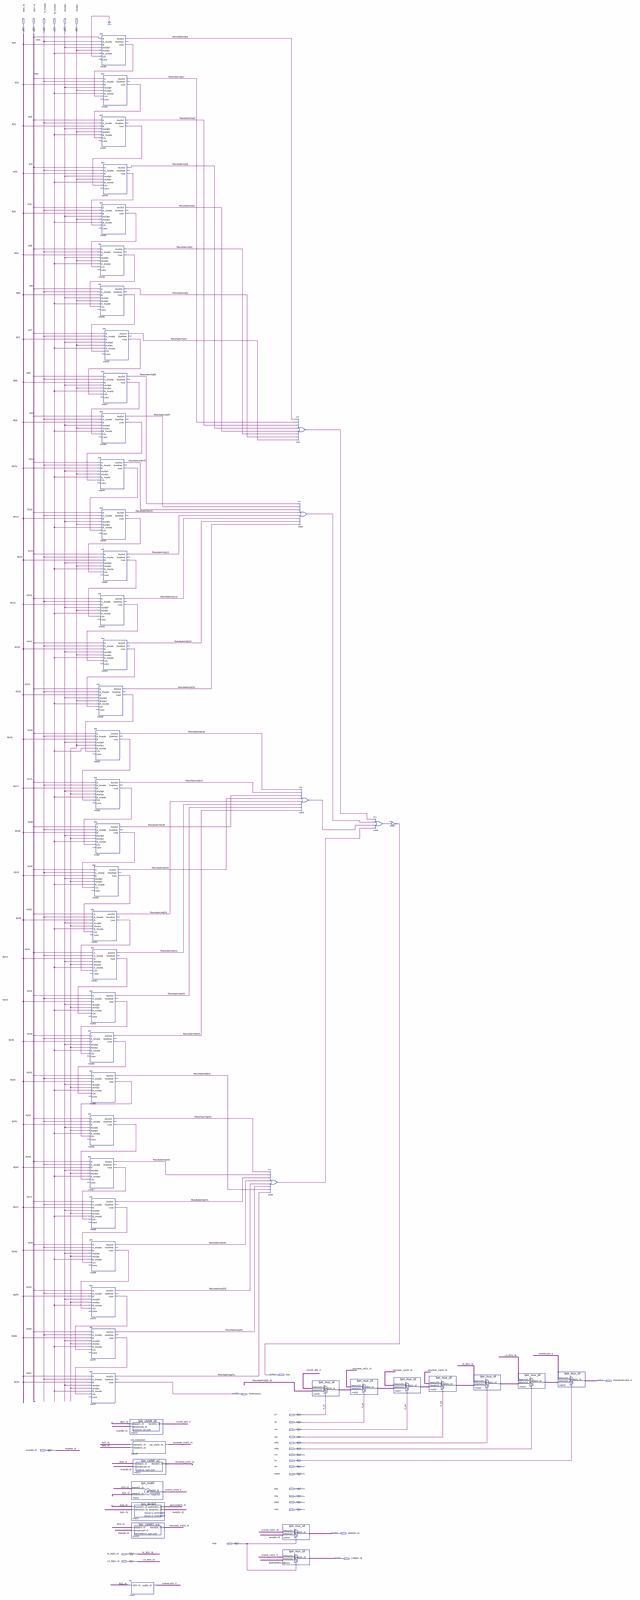
[diagram p0: schematic sheet, whole]
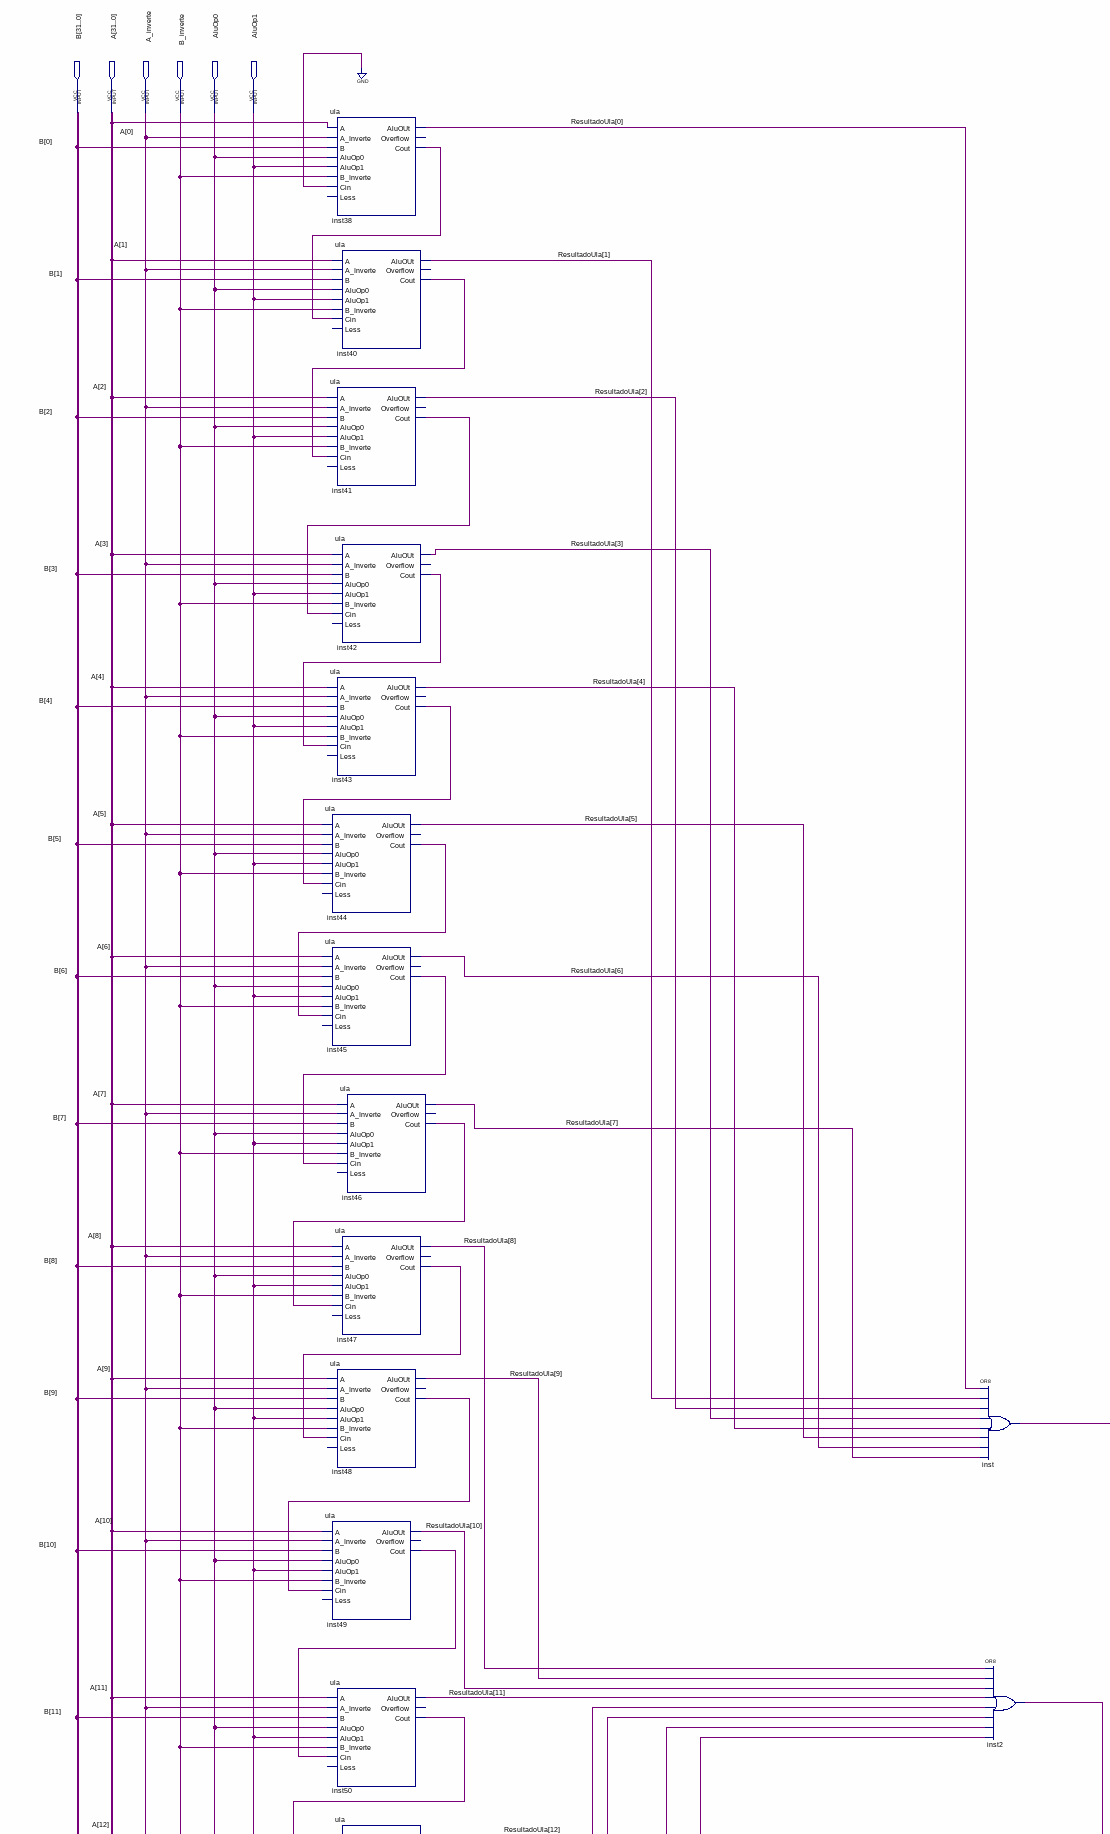
[diagram p1: schematic sheet, upper left part]
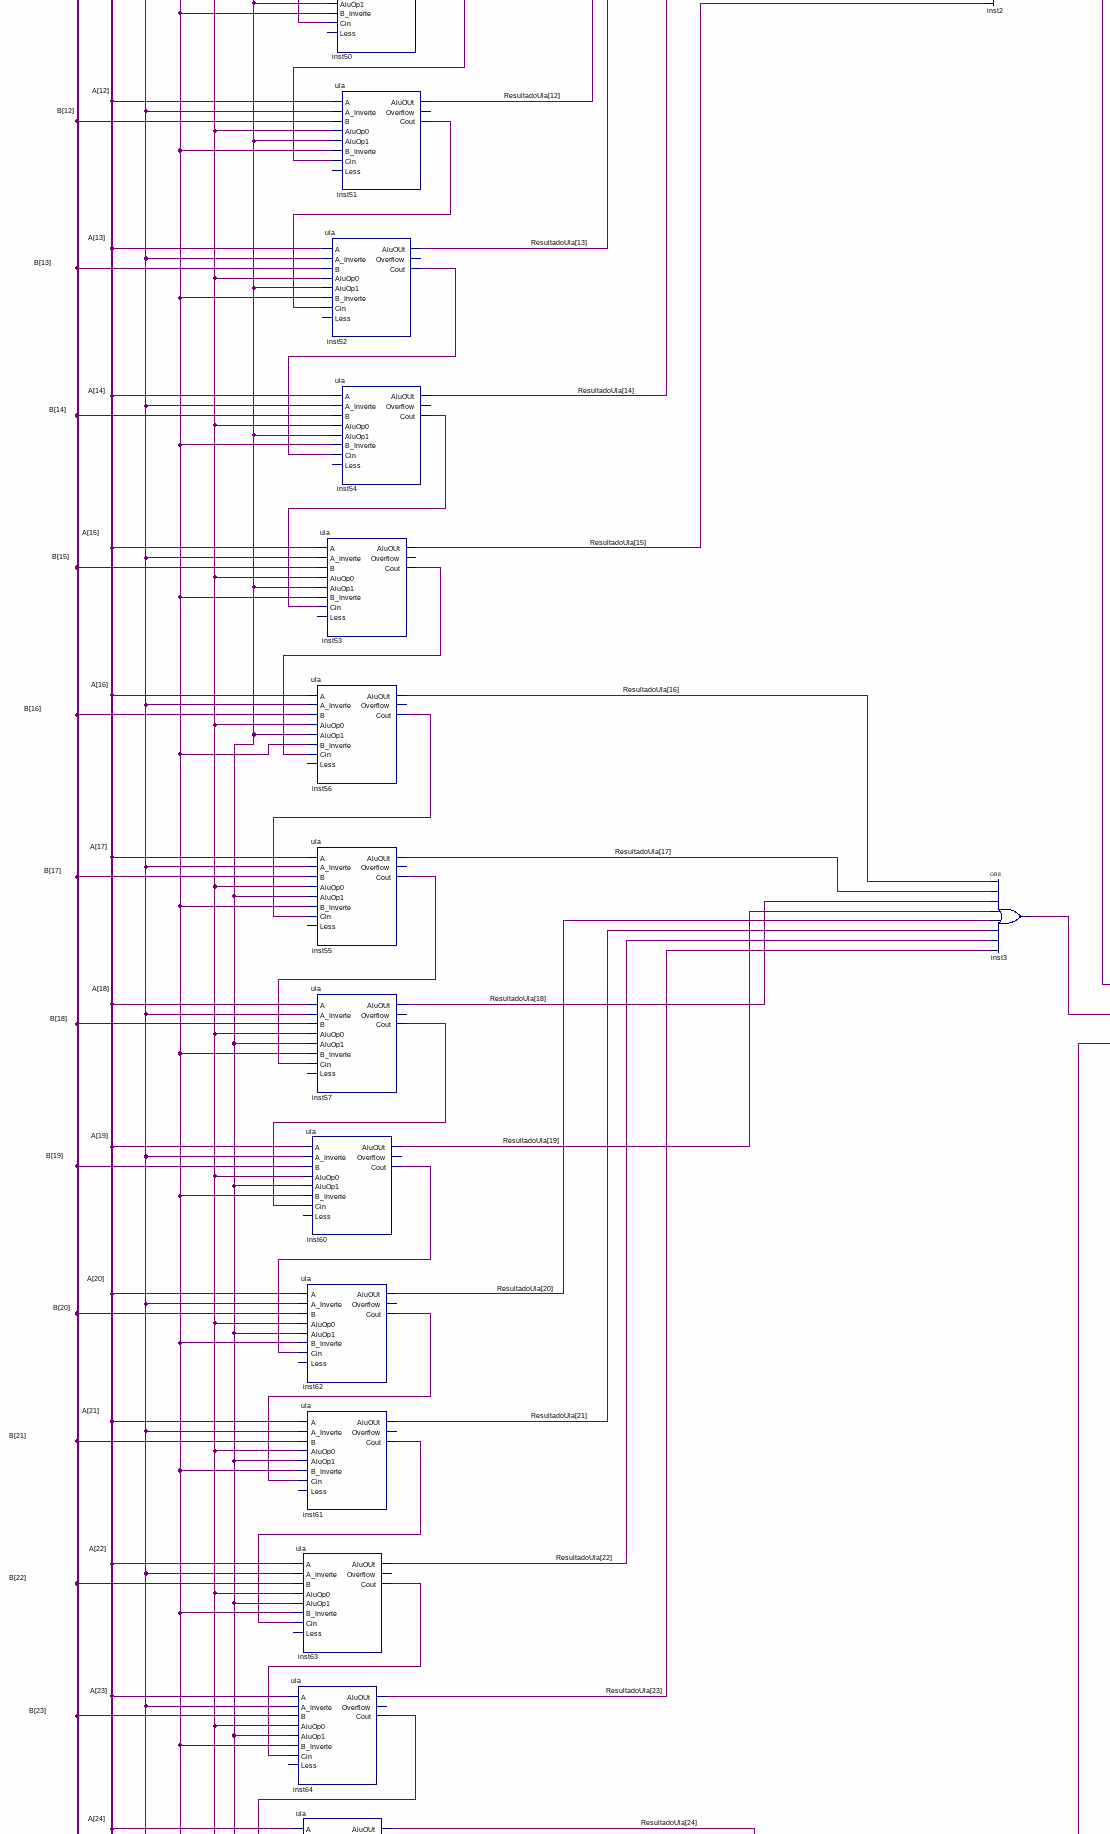
[diagram p2: schematic sheet, middle left part]
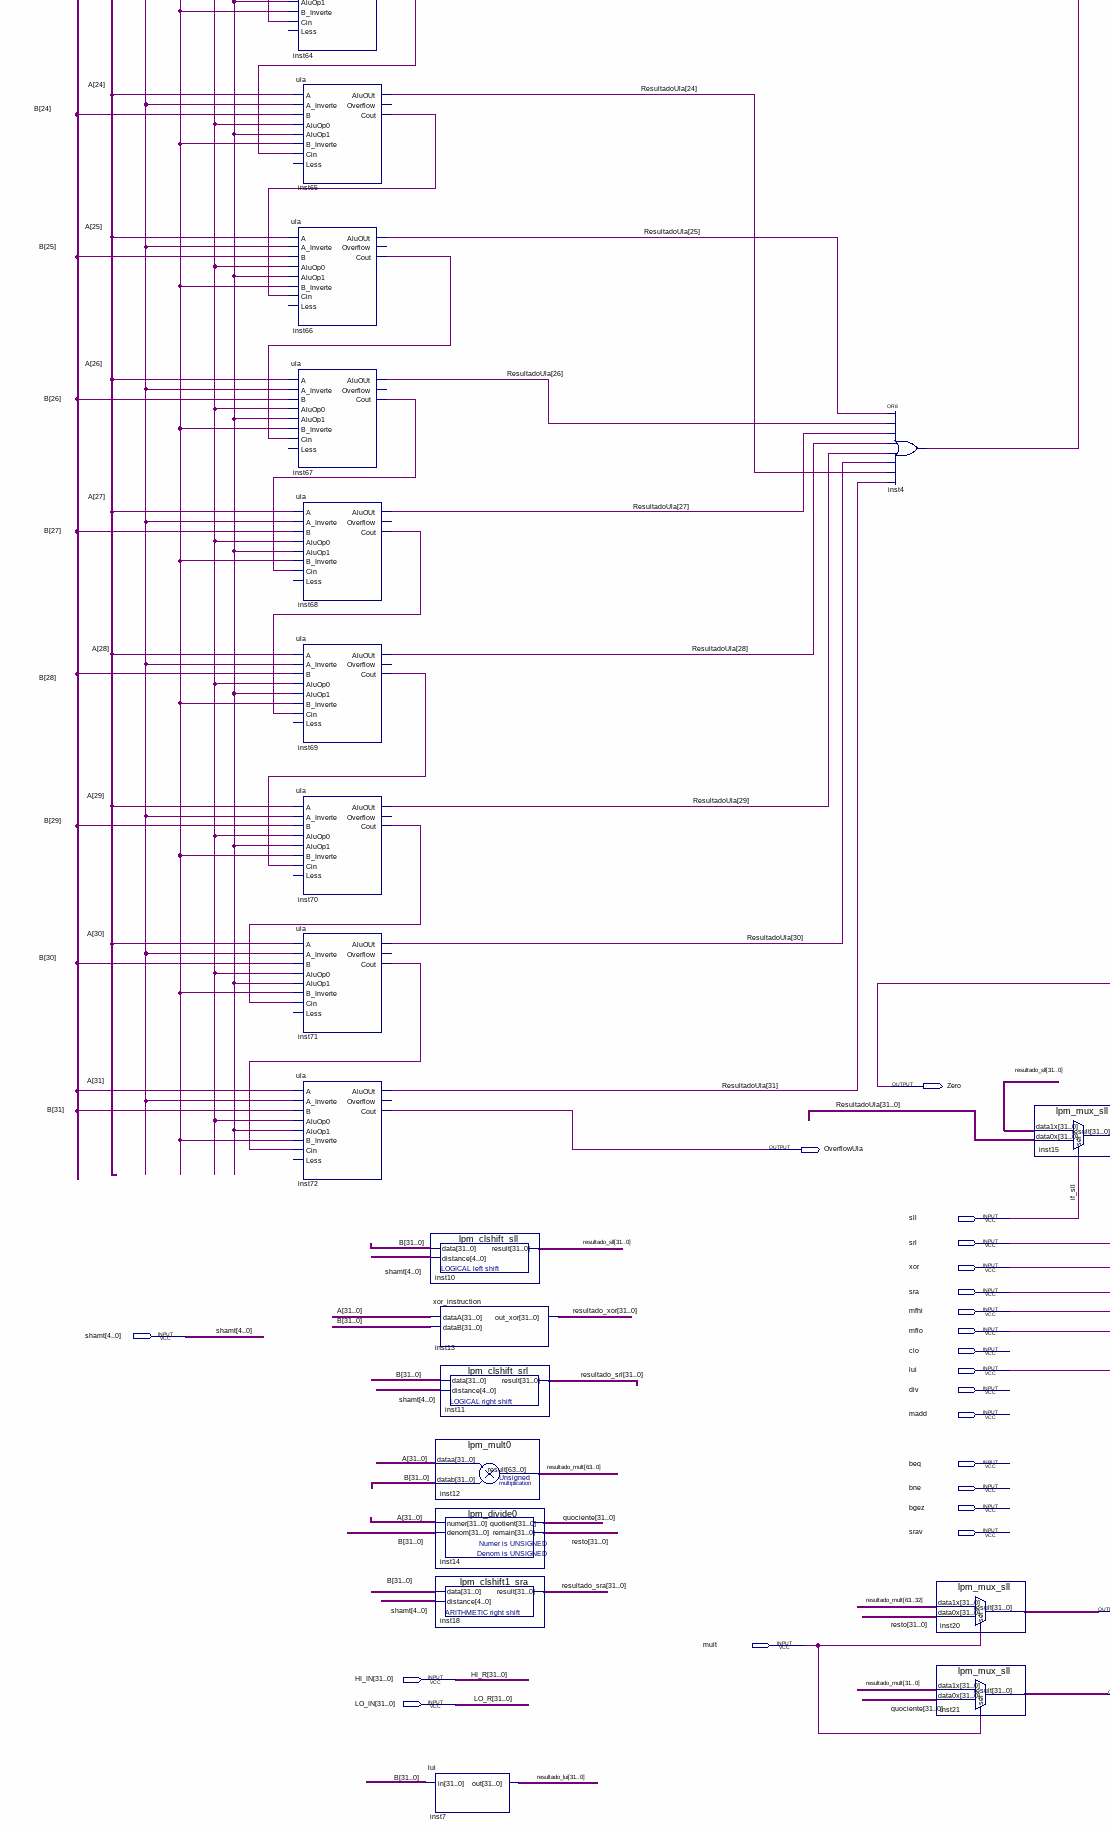
[diagram p3: schematic sheet, lower left part]
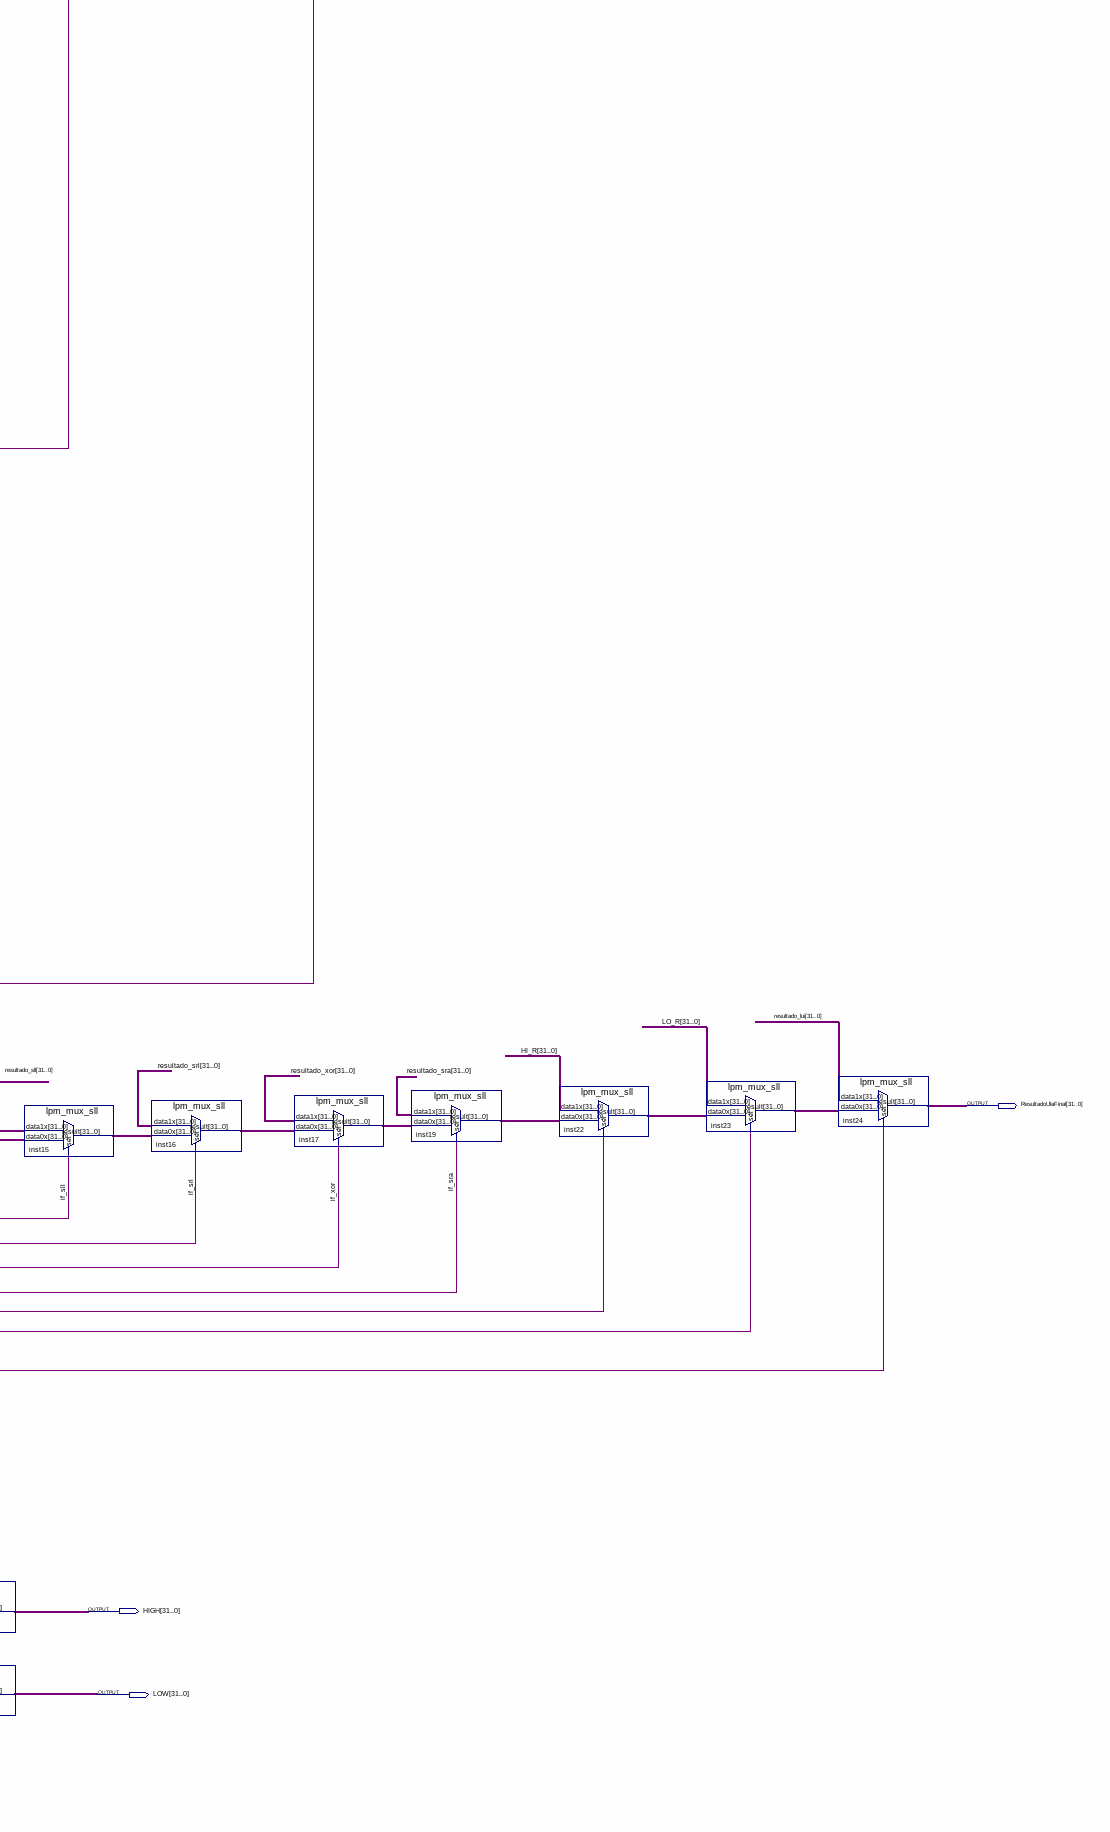
[diagram p4: schematic sheet, lower right part]
// Quartus schematic ula32bit.bdf as structural Verilog: 54 symbols, 29 pins
module ula32bit (
  input  [31:0] B,
  input  [31:0] A,
  input  A_inverte,
  input  B_inverte,
  input  AluOp0,
  input  AluOp1,
  input  sll,
  input  srl,
  input  \xor ,
  input  sra,
  input  mfhi,
  input  mflo,
  input  [4:0] shamt,
  input  clo,
  input  lui,
  input  div,
  input  madd,
  input  beq,
  input  bne,
  input  bgez,
  input  srav,
  input  mult,
  input  [31:0] HI_IN,
  input  [31:0] LO_IN,
  output Zero,
  output [31:0] ResultadoUlaFinal,
  output OverflowUla,
  output [31:0] HIGH,
  output [31:0] LOW
);

  wire inst2_out, inst3_out, inst4_out, inst5_out, inst38_cout, inst40_cout, inst41_cout, inst42_cout,
       inst43_cout, inst44_cout, inst45_cout, inst46_cout, inst47_cout, inst48_cout, inst49_cout,
       inst50_cout, inst51_cout, inst52_cout, inst53_cout, inst54_cout, inst55_cout, inst56_cout,
       inst57_cout, inst60_cout, inst61_cout, inst62_cout, inst63_cout, inst64_cout, inst65_cout,
       inst66_cout, inst67_cout, inst68_cout, inst69_cout, inst70_cout, inst71_cout, inst_out;
  wire [31:0] inst15_result, inst16_result, inst17_result, inst19_result, inst22_result, inst23_result,
       quociente, resto, resultado_lui, resultado_sll, resultado_sra, resultado_srl, resultado_xor,
       ResultadoUla;
  wire [63:0] resultado_mult;

  ula inst44 (
    .A(A[5]), .A_Inverte(A_inverte), .B(B[5]), .AluOp0(AluOp0), .AluOp1(AluOp1), .B_Inverte(B_inverte),
    .Cin(inst43_cout), .AluOUt(ResultadoUla[5]), .Cout(inst44_cout));  // open: Less, Overflow
  ula inst45 (
    .A(A[6]), .A_Inverte(A_inverte), .B(B[6]), .AluOp0(AluOp0), .AluOp1(AluOp1), .B_Inverte(B_inverte),
    .Cin(inst44_cout), .AluOUt(ResultadoUla[6]), .Cout(inst45_cout));  // open: Less, Overflow
  ula inst49 (
    .A(A[10]), .A_Inverte(A_inverte), .B(B[10]), .AluOp0(AluOp0), .AluOp1(AluOp1), .B_Inverte(B_inverte),
    .Cin(inst48_cout), .AluOUt(ResultadoUla[10]), .Cout(inst49_cout));  // open: Less, Overflow
  ula inst52 (
    .A(A[13]), .A_Inverte(A_inverte), .B(B[13]), .AluOp0(AluOp0), .AluOp1(AluOp1), .B_Inverte(B_inverte),
    .Cin(inst51_cout), .AluOUt(ResultadoUla[13]), .Cout(inst52_cout));  // open: Less, Overflow
  ula inst53 (
    .A(A[15]), .A_Inverte(A_inverte), .B(B[15]), .AluOp0(AluOp0), .AluOp1(AluOp1), .B_Inverte(B_inverte),
    .Cin(inst54_cout), .AluOUt(ResultadoUla[15]), .Cout(inst53_cout));  // open: Less, Overflow
  ula inst56 (
    .A(A[16]), .A_Inverte(A_inverte), .B(B[16]), .AluOp0(AluOp0), .AluOp1(AluOp1), .B_Inverte(B_inverte),
    .Cin(inst53_cout), .AluOUt(ResultadoUla[16]), .Cout(inst56_cout));  // open: Less, Overflow
  ula inst55 (
    .A(A[17]), .A_Inverte(A_inverte), .B(B[17]), .AluOp0(AluOp0), .AluOp1(AluOp1), .B_Inverte(B_inverte),
    .Cin(inst56_cout), .AluOUt(ResultadoUla[17]), .Cout(inst55_cout));  // open: Less, Overflow
  ula inst57 (
    .A(A[18]), .A_Inverte(A_inverte), .B(B[18]), .AluOp0(AluOp0), .AluOp1(AluOp1), .B_Inverte(B_inverte),
    .Cin(inst55_cout), .AluOUt(ResultadoUla[18]), .Cout(inst57_cout));  // open: Less, Overflow
  ula inst60 (
    .A(A[19]), .A_Inverte(A_inverte), .B(B[19]), .AluOp0(AluOp0), .AluOp1(AluOp1), .B_Inverte(B_inverte),
    .Cin(inst57_cout), .AluOUt(ResultadoUla[19]), .Cout(inst60_cout));  // open: Less, Overflow
  ula inst62 (
    .A(A[20]), .A_Inverte(A_inverte), .B(B[20]), .AluOp0(AluOp0), .AluOp1(AluOp1), .B_Inverte(B_inverte),
    .Cin(inst60_cout), .AluOUt(ResultadoUla[20]), .Cout(inst62_cout));  // open: Less, Overflow
  ula inst61 (
    .A(A[21]), .A_Inverte(A_inverte), .B(B[21]), .AluOp0(AluOp0), .AluOp1(AluOp1), .B_Inverte(B_inverte),
    .Cin(inst62_cout), .AluOUt(ResultadoUla[21]), .Cout(inst61_cout));  // open: Less, Overflow
  ula inst63 (
    .A(A[22]), .A_Inverte(A_inverte), .B(B[22]), .AluOp0(AluOp0), .AluOp1(AluOp1), .B_Inverte(B_inverte),
    .Cin(inst61_cout), .AluOUt(ResultadoUla[22]), .Cout(inst63_cout));  // open: Less, Overflow
  ula inst64 (
    .A(A[23]), .A_Inverte(A_inverte), .B(B[23]), .AluOp0(AluOp0), .AluOp1(AluOp1), .B_Inverte(B_inverte),
    .Cin(inst63_cout), .AluOUt(ResultadoUla[23]), .Cout(inst64_cout));  // open: Less, Overflow
  ula inst65 (
    .A(A[24]), .A_Inverte(A_inverte), .B(B[24]), .AluOp0(AluOp0), .AluOp1(AluOp1), .B_Inverte(B_inverte),
    .Cin(inst64_cout), .AluOUt(ResultadoUla[24]), .Cout(inst65_cout));  // open: Less, Overflow
  ula inst66 (
    .A(A[25]), .A_Inverte(A_inverte), .B(B[25]), .AluOp0(AluOp0), .AluOp1(AluOp1), .B_Inverte(B_inverte),
    .Cin(inst65_cout), .AluOUt(ResultadoUla[25]), .Cout(inst66_cout));  // open: Less, Overflow
  ula inst67 (
    .A(A[26]), .A_Inverte(A_inverte), .B(B[26]), .AluOp0(AluOp0), .AluOp1(AluOp1), .B_Inverte(B_inverte),
    .Cin(inst66_cout), .AluOUt(ResultadoUla[26]), .Cout(inst67_cout));  // open: Less, Overflow
  ula inst68 (
    .A(A[27]), .A_Inverte(A_inverte), .B(B[27]), .AluOp0(AluOp0), .AluOp1(AluOp1), .B_Inverte(B_inverte),
    .Cin(inst67_cout), .AluOUt(ResultadoUla[27]), .Cout(inst68_cout));  // open: Less, Overflow
  ula inst69 (
    .A(A[28]), .A_Inverte(A_inverte), .B(B[28]), .AluOp0(AluOp0), .AluOp1(AluOp1), .B_Inverte(B_inverte),
    .Cin(inst68_cout), .AluOUt(ResultadoUla[28]), .Cout(inst69_cout));  // open: Less, Overflow
  ula inst70 (
    .A(A[29]), .A_Inverte(A_inverte), .B(B[29]), .AluOp0(AluOp0), .AluOp1(AluOp1), .B_Inverte(B_inverte),
    .Cin(inst69_cout), .AluOUt(ResultadoUla[29]), .Cout(inst70_cout));  // open: Less, Overflow
  ula inst71 (
    .A(A[30]), .A_Inverte(A_inverte), .B(B[30]), .AluOp0(AluOp0), .AluOp1(AluOp1), .B_Inverte(B_inverte),
    .Cin(inst70_cout), .AluOUt(ResultadoUla[30]), .Cout(inst71_cout));  // open: Less, Overflow
  ula inst72 (
    .A(A[31]), .A_Inverte(A_inverte), .B(B[31]), .AluOp0(AluOp0), .AluOp1(AluOp1), .B_Inverte(B_inverte),
    .Cin(inst71_cout), .AluOUt(ResultadoUla[31]), .Cout(OverflowUla));  // open: Less, Overflow
  ula inst38 (
    .A(A[0]), .A_Inverte(A_inverte), .B(B[0]), .AluOp0(AluOp0), .AluOp1(AluOp1), .B_Inverte(B_inverte),
    .Cin(1'b0), .AluOUt(ResultadoUla[0]), .Cout(inst38_cout));  // open: Less, Overflow
  ula inst40 (
    .A(A[1]), .A_Inverte(A_inverte), .B(B[1]), .AluOp0(AluOp0), .AluOp1(AluOp1), .B_Inverte(B_inverte),
    .Cin(inst38_cout), .AluOUt(ResultadoUla[1]), .Cout(inst40_cout));  // open: Less, Overflow
  ula inst41 (
    .A(A[2]), .A_Inverte(A_inverte), .B(B[2]), .AluOp0(AluOp0), .AluOp1(AluOp1), .B_Inverte(B_inverte),
    .Cin(inst40_cout), .AluOUt(ResultadoUla[2]), .Cout(inst41_cout));  // open: Less, Overflow
  ula inst42 (
    .A(A[3]), .A_Inverte(A_inverte), .B(B[3]), .AluOp0(AluOp0), .AluOp1(AluOp1), .B_Inverte(B_inverte),
    .Cin(inst41_cout), .AluOUt(ResultadoUla[3]), .Cout(inst42_cout));  // open: Less, Overflow
  ula inst43 (
    .A(A[4]), .A_Inverte(A_inverte), .B(B[4]), .AluOp0(AluOp0), .AluOp1(AluOp1), .B_Inverte(B_inverte),
    .Cin(inst42_cout), .AluOUt(ResultadoUla[4]), .Cout(inst43_cout));  // open: Less, Overflow
  ula inst46 (
    .A(A[7]), .A_Inverte(A_inverte), .B(B[7]), .AluOp0(AluOp0), .AluOp1(AluOp1), .B_Inverte(B_inverte),
    .Cin(inst45_cout), .AluOUt(ResultadoUla[7]), .Cout(inst46_cout));  // open: Less, Overflow
  ula inst47 (
    .A(A[8]), .A_Inverte(A_inverte), .B(B[8]), .AluOp0(AluOp0), .AluOp1(AluOp1), .B_Inverte(B_inverte),
    .Cin(inst46_cout), .AluOUt(ResultadoUla[8]), .Cout(inst47_cout));  // open: Less, Overflow
  ula inst48 (
    .A(A[9]), .A_Inverte(A_inverte), .B(B[9]), .AluOp0(AluOp0), .AluOp1(AluOp1), .B_Inverte(B_inverte),
    .Cin(inst47_cout), .AluOUt(ResultadoUla[9]), .Cout(inst48_cout));  // open: Less, Overflow
  ula inst50 (
    .A(A[11]), .A_Inverte(A_inverte), .B(B[11]), .AluOp0(AluOp0), .AluOp1(AluOp1), .B_Inverte(B_inverte),
    .Cin(inst49_cout), .AluOUt(ResultadoUla[11]), .Cout(inst50_cout));  // open: Less, Overflow
  ula inst51 (
    .A(A[12]), .A_Inverte(A_inverte), .B(B[12]), .AluOp0(AluOp0), .AluOp1(AluOp1), .B_Inverte(B_inverte),
    .Cin(inst50_cout), .AluOUt(ResultadoUla[12]), .Cout(inst51_cout));  // open: Less, Overflow
  ula inst54 (
    .A(A[14]), .A_Inverte(A_inverte), .B(B[14]), .AluOp0(AluOp0), .AluOp1(AluOp1), .B_Inverte(B_inverte),
    .Cin(inst52_cout), .AluOUt(ResultadoUla[14]), .Cout(inst54_cout));  // open: Less, Overflow
  lpm_clshift_sll inst10 (.data(B), .distance(shamt), .result(resultado_sll));
  xor_instruction inst13 (.dataA(A), .dataB(B), .out_xor(resultado_xor));
  lpm_clshift_srl inst11 (.data(B), .distance(shamt), .result(resultado_srl));
  lpm_mult0 inst12 (.dataa(A), .datab(B), .result(resultado_mult));
  lpm_divide0 inst14 (.numer(A), .denom(B), .quotient(quociente), .remain(resto));
  lpm_clshift1_sra inst18 (.data(B), .distance(shamt), .result(resultado_sra));
  lui inst7 (.in(B), .out(resultado_lui));
  or inst4 (inst4_out, ResultadoUla[25], ResultadoUla[26], ResultadoUla[27], ResultadoUla[28], ResultadoUla[29], ResultadoUla[30], ResultadoUla[24], ResultadoUla[31]);
  lpm_mux_sll inst20 (.data1x(resultado_mult[63:32]), .data0x(resto), .sel(mult), .result(HIGH));
  lpm_mux_sll inst21 (.data1x(resultado_mult[31:0]), .data0x(quociente), .sel(mult), .result(LOW));
  or inst (inst_out, ResultadoUla[0], ResultadoUla[1], ResultadoUla[2], ResultadoUla[3], ResultadoUla[4], ResultadoUla[5], ResultadoUla[6], ResultadoUla[7]);
  or inst2 (inst2_out, ResultadoUla[8], ResultadoUla[9], ResultadoUla[10], ResultadoUla[11], ResultadoUla[12], ResultadoUla[13], ResultadoUla[14], ResultadoUla[15]);
  or inst3 (inst3_out, ResultadoUla[16], ResultadoUla[17], ResultadoUla[18], ResultadoUla[19], ResultadoUla[20], ResultadoUla[21], ResultadoUla[22], ResultadoUla[23]);
  lpm_mux_sll inst15 (.data1x(resultado_sll), .data0x(ResultadoUla), .sel(sll), .result(inst15_result));
  lpm_mux_sll inst16 (.data1x(resultado_srl), .data0x(inst15_result), .sel(srl), .result(inst16_result));
  or inst5 (inst5_out, inst_out, inst2_out, inst3_out, inst4_out);
  not inst6 (Zero, inst5_out);
  lpm_mux_sll inst17 (.data1x(resultado_xor), .data0x(inst16_result), .sel(\xor ), .result(inst17_result));
  lpm_mux_sll inst19 (.data1x(resultado_sra), .data0x(inst17_result), .sel(sra), .result(inst19_result));
  lpm_mux_sll inst22 (.data1x(HI_IN), .data0x(inst19_result), .sel(mfhi), .result(inst22_result));
  lpm_mux_sll inst23 (.data1x(LO_IN), .data0x(inst22_result), .sel(mflo), .result(inst23_result));
  lpm_mux_sll inst24 (.data1x(resultado_lui), .data0x(inst23_result), .sel(lui), .result(ResultadoUlaFinal));

  // Other names for the same wires on the sheet: HI_R[31:0] = HI_IN; if_sll = sll; if_sra = sra; if_srl = srl;
  //   if_xor = \xor ; LO_R[31:0] = LO_IN
endmodule
